# EAGLE design FRDM-Shield-Rev1.1 (EAGLE 6.4)
FRDM-Robot Shield for MC1320x RF Daughter Board
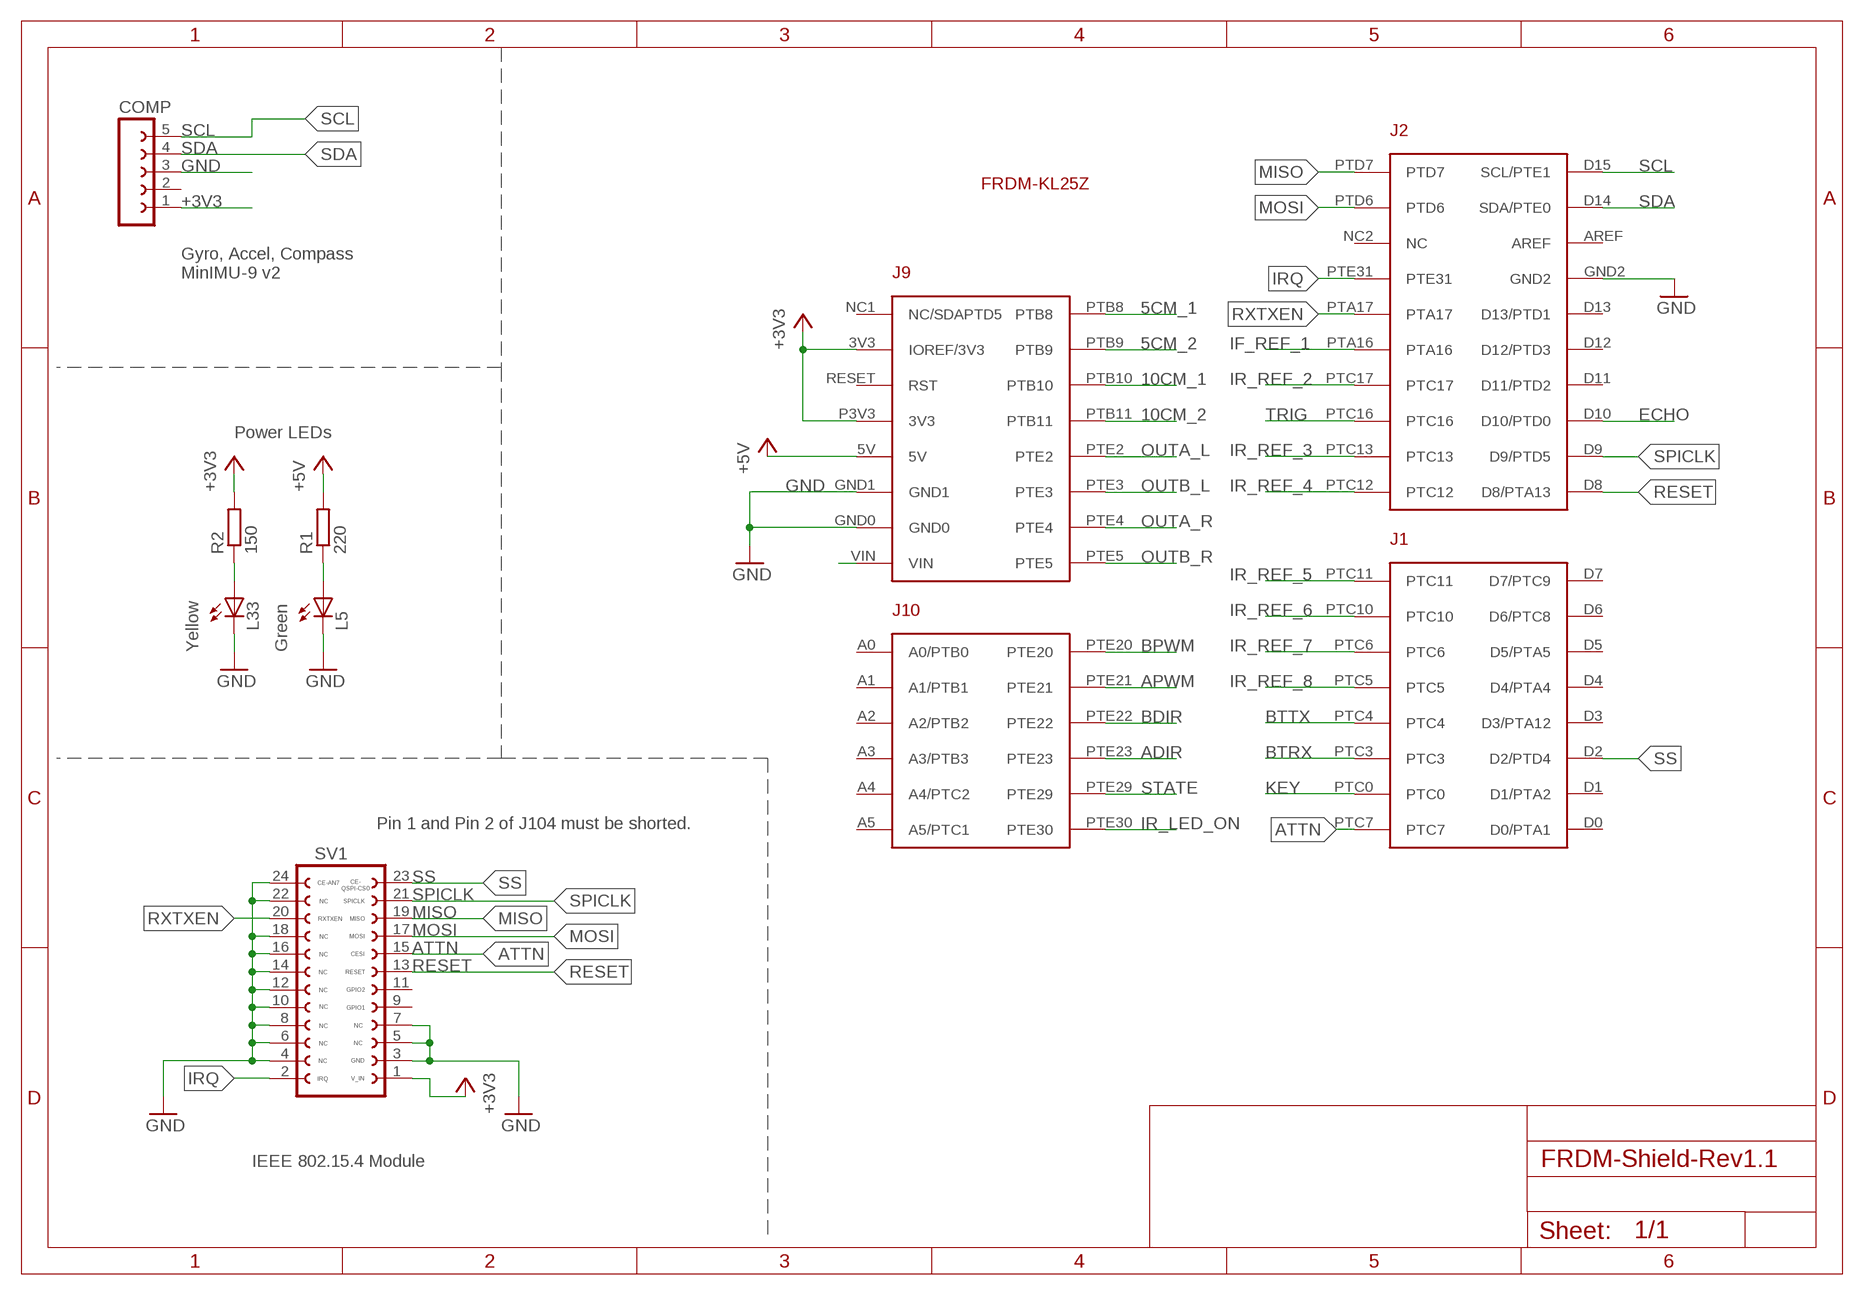
[diagram p0: schematic, sheet 1]

## Parts
COMP  FE05-1  [FE05-1]
FRDM1  FRDM-KL25ZARDUINO  [FRDM-KL25Z]
L5  LEDCHIP-LED0603  [CHIP-LED0603]
L33  LEDCHIP-LED0603  [CHIP-LED0603]
R1  220  R-EU_M0805  [M0805]
R2  150  R-EU_M0805  [M0805]
SV1  MC1320X  [FE12-2]

## Nets
5CM_1: FRDM1.PTB8
5CM_2: FRDM1.PTB9
10CM_1: FRDM1.PTB10
10CM_2: FRDM1.PTB11
+3V3: COMP.1 FRDM1.3V3(IOREF/3V3) FRDM1.P3V3(3V3) R2.2 SV1.1
+5V: FRDM1.5V R1.2
ADIR: FRDM1.PTE23
APWM: FRDM1.PTE21
ATTN: FRDM1.PTC7 SV1.15
BDIR: FRDM1.PTE22
BPWM: FRDM1.PTE20
BTRX: FRDM1.PTC3
BTTX: FRDM1.PTC4
ECHO: FRDM1.D10(D10/PTD0)
GND: COMP.3 FRDM1.GND0 FRDM1.GND1 FRDM1.GND2 L5.C L33.C SV1.3 SV1.4 SV1.5 SV1.6 SV1.7 SV1.8 SV1.10 SV1.12 SV1.14 SV1.16 SV1.18 SV1.22 SV1.24
IF_REF_1: FRDM1.PTA16
IR_LED_ON: FRDM1.PTE30
IR_REF_2: FRDM1.PTC17
IR_REF_3: FRDM1.PTC13
IR_REF_4: FRDM1.PTC12
IR_REF_5: FRDM1.PTC11
IR_REF_6: FRDM1.PTC10
IR_REF_7: FRDM1.PTC6
IR_REF_8: FRDM1.PTC5
IRQ: FRDM1.PTE31 SV1.2
KEY: FRDM1.PTC0
MISO: FRDM1.PTD7 SV1.19
MOSI: FRDM1.PTD6 SV1.17
N$1: FRDM1.VIN
N$4: L5.A R1.1
N$5: L33.A R2.1
OUTA_L: FRDM1.PTE2
OUTA_R: FRDM1.PTE4
OUTB_L: FRDM1.PTE3
OUTB_R: FRDM1.PTE5
RESET: FRDM1.D8(D8/PTA13) SV1.13
RXTXEN: FRDM1.PTA17 SV1.20
SCL: COMP.5 FRDM1.D15(SCL/PTE1)
SDA: COMP.4 FRDM1.D14(SDA/PTE0)
SPICLK: FRDM1.D9(D9/PTD5) SV1.21
SS: FRDM1.D2(D2/PTD4) SV1.23
STATE: FRDM1.PTE29
TRIG: FRDM1.PTC16
Unconnected: COMP.2 FRDM1.A0(A0/PTB0) FRDM1.A1(A1/PTB1) FRDM1.A2(A2/PTB2) FRDM1.A3(A3/PTB3) FRDM1.A4(A4/PTC2) FRDM1.A5(A5/PTC1) FRDM1.AREF FRDM1.D0(D0/PTA1) FRDM1.D1(D1/PTA2) FRDM1.D3(D3/PTA12) FRDM1.D4(D4/PTA4) FRDM1.D5(D5/PTA5) FRDM1.D6(D6/PTC8) FRDM1.D7(D7/PTC9) FRDM1.D11(D11/PTD2) FRDM1.D12(D12/PTD3) FRDM1.D13(D13/PTD1) FRDM1.NC1(NC/SDAPTD5) FRDM1.NC2(NC) FRDM1.RESET(RST) SV1.9 SV1.11

## Notes on the sheet
- Gyro, Accel, Compass
  MinIMU-9 v2
- Power LEDs
- Yellow | Green
- Pin 1 and Pin 2 of J104 must be shorted.
- IEEE 802.15.4 Module

## Library data of the parts
COMP = con-lsta-FRDM:FE05-1: FEMALE HEADER; OC_FARNELL: unknown; OC_NEWARK: unknown
FRDM1 = Freedom:FRDM-KL25Z: For creating FRDM-KL25Z shields
L5 L33 = led:LED: LED OSRAM: - CHIPLED LG R971, LG N971, LY N971, LG Q971, LY Q971, LO R971, LY R971 LH N974, LH R974 LS Q976, LO Q976, LY Q976 LO Q996 - Hyper CHIPLED LW Q18S LB Q993, LB Q99A, LB R99A - SideLED LS A670, LO A670, LY A670, LG A670, LP A670 LB A673, LV A673, LT A673, LW A673 LH A674 LY A675 LS A676, LA A676, LO A676, LY A676, LW A676 LS A679, LY A679, LG A679 - Hyper Micro SIDELED® LS Y876, LA Y876, LO Y876, LY Y876 LT Y87S - SmartLED LW L88C, LW L88S LB L89C, LB L89S, LG L890 LS L89K, LO L89K, LY L89K LS L896, LA L896, LO L896, LY L896 - TOPLED LS T670, LO T670, LY T670, LG T670, LP T670 LSG T670, LSP T670, LSY T670, LOP T670, LYG T670 LG T671, LOG T671, LSG T671 LB T673, LV T673, LT T673, LW T673 LH T674 LS T676, LA T676, LO T676, LY T676, LB T676, LH T676, LSB T676, LW T676 LB T67C, LV T67C, LT T67C, LS T67K, LO T67K, LY T67K, LW E67C LS E67B, LA E67B, LO E67B, LY E67B, LB E67C, LV E67C, LT E67C LW T67C LS T679, LY T679, LG T679 LS T770, LO T770, LY T770, LG T770, LP T770 LB T773, LV T773, LT T773, LW T773 LH T774 LS E675, LA E675, LY E675, LS T675 LS T776, LA T776, LO T776, LY T776, LB T776 LHGB T686 LT T68C, LB T68C - Hyper Mini TOPLED® LB M676 - Mini TOPLED Santana® LG M470 LS M47K, LO M47K, LY M47K Source: http://www.osram.convergy.de LUXEON: - LUMILED® LXK2-PW12-R00, LXK2-PW12-S00, LXK2-PW14-U00, LXK2-PW14-V00 LXK2-PM12-R00, LXK2-PM12-S00, LXK2-PM14-U00 LXK2-PE12-Q00, LXK2-PE12-R00, LXK2-PE12-S00, LXK2-PE14-T00, LXK2-PE14-U00 LXK2-PB12-K00, LXK2-PB12-L00, LXK2-PB12-M00, LXK2-PB14-N00, LXK2-PB14-P00, LXK2-PB14-Q00 LXK2-PR12-L00, LXK2-PR12-M00, LXK2-PR14-Q00, LXK2-PR14-R00 LXK2-PD12-Q00, LXK2-PD12-R00, LXK2-PD12-S00 LXK2-PH12-R00, LXK2-PH12-S00 LXK2-PL12-P00, LXK2-PL12-Q00, LXK2-PL12-R00 Source: www.luxeon.com KINGBRIGHT: KA-3528ASYC Source: www.kingbright.com
R1 R2 = resistor:R-EU_: RESISTOR, European symbol
SV1 = Freescale MC1320x-FRDM:MC1320X: Freescale MC1320x RF Daughter Board Connector

## Board
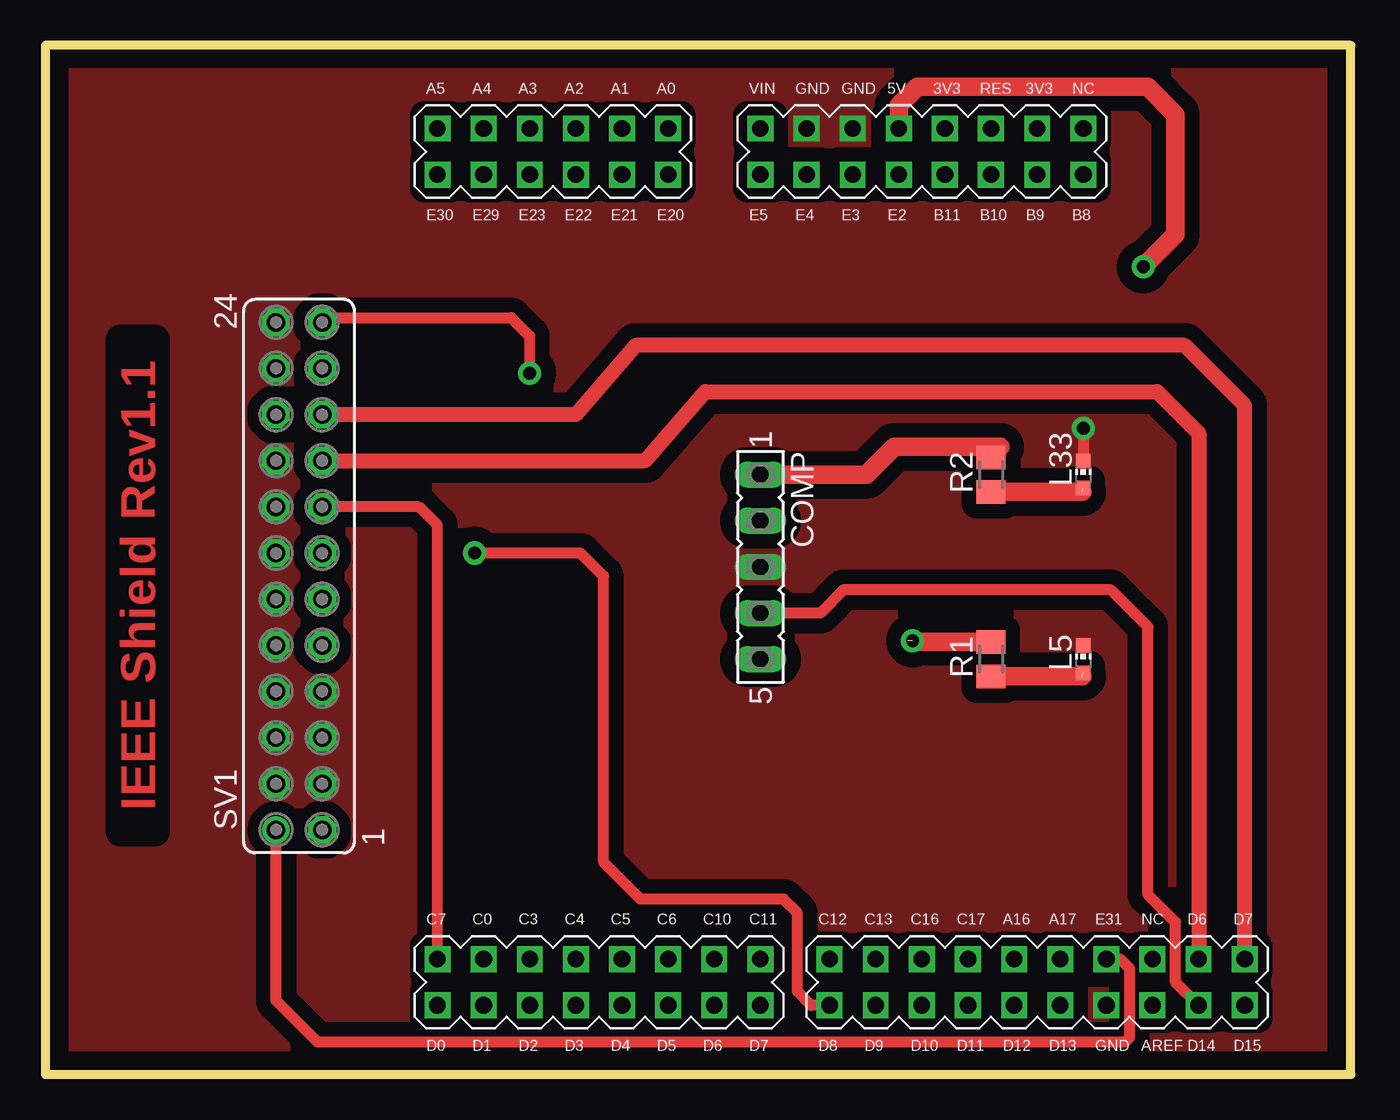
[diagram p1: board, top side]
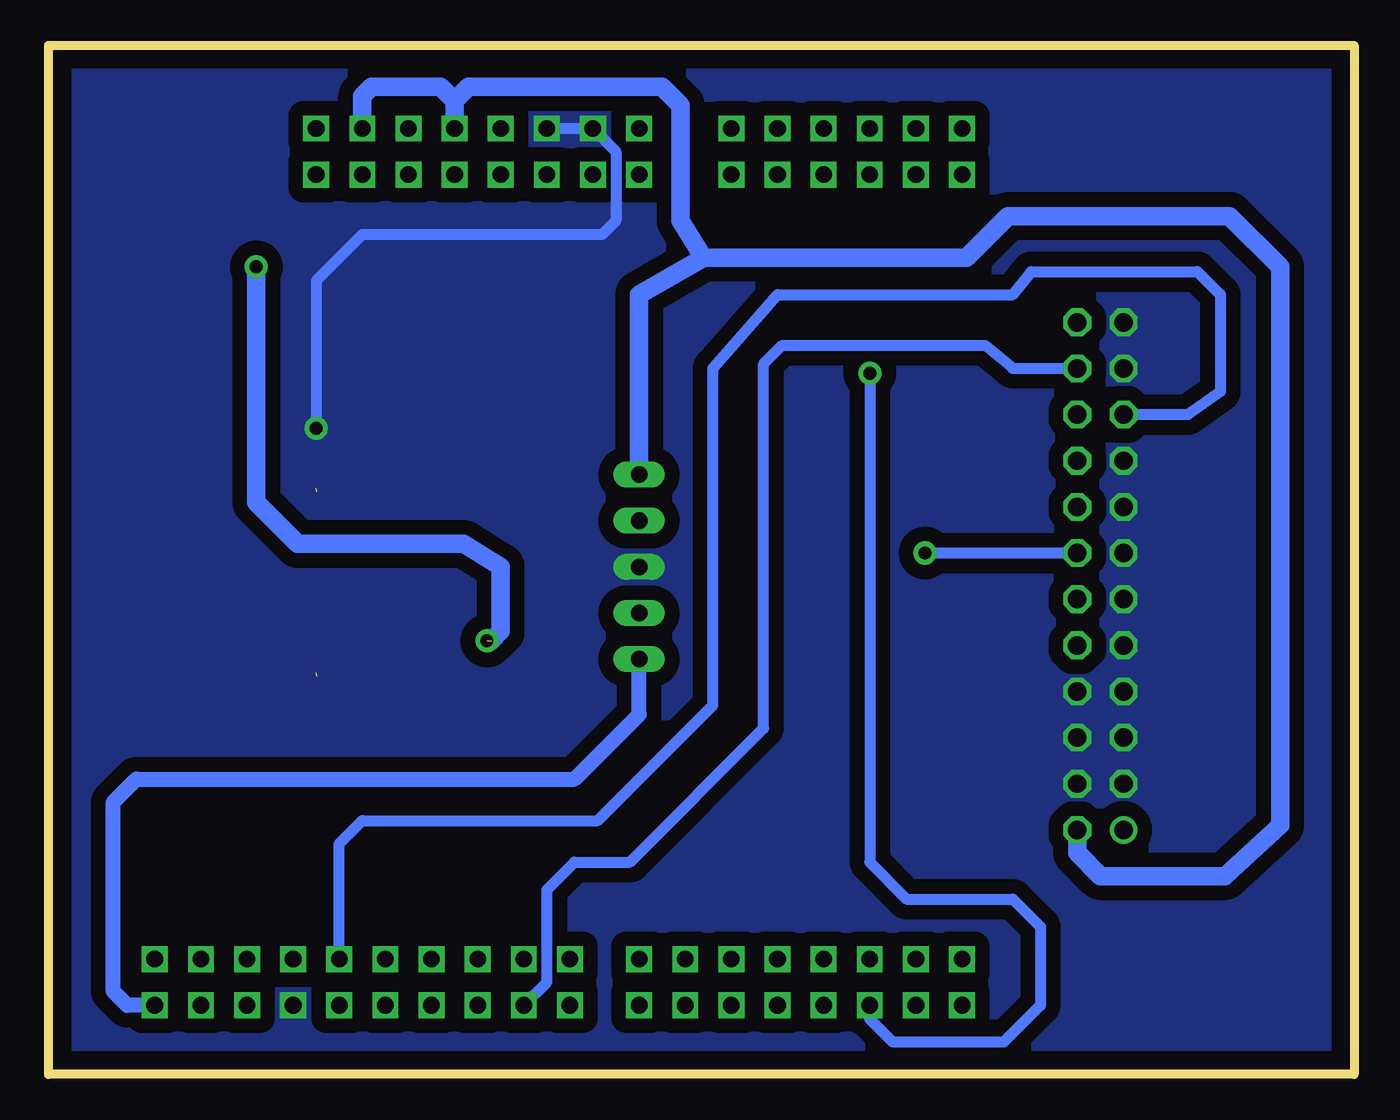
[diagram p2: board, bottom side, seen from below]

Size 72.06 x 56.64 mm. Coordinates in mm from the lower left corner, seen from the top.
Outline: 0,0 72.06,0 72.06,56.63 0,56.63 0,0
Outline: 0,0 71.88,0 71.88,56.64 0,56.64 0,0
Copper layers (1*16): Top 0.035mm / dielectric 1.5mm / Bottom 0.035mm
Design rules "default": minimum track width 10mil, minimum drill 24mil, track to track 8mil, track to pad 8mil, pad to pad 8mil, via to via 8mil, smd to smd 8mil, copper to edge 40mil, drill to drill 8mil, minimum pad ring 10mil, minimum via ring 8mil, stop-mask expansion 4mil, vias tented up to drill 0mil, thermal gap 10mil

### Footprints (pad centres in the part's own frame; a part is rotated, then mirrored left to right if it is on the bottom)
FE05-1 = drill 0.914 long: 1 -5.08,0; 2 -2.54,0; 3 0,0; 4 2.54,0; 5 5.08,0
FRDM-KL25Z = drill 0.914 square: 3V3 -22.86,12.7; 5V -22.86,5.08; A0 -22.86,-7.62; A1 -22.86,-10.16; A2 -22.86,-12.7; A3 -22.86,-15.24; A4 -22.86,-17.78; A5 -22.86,-20.32; AREF 25.4,19.05; D0 25.4,-20.32; D1 25.4,-17.78; D2 25.4,-15.24; D3 25.4,-12.7; D4 25.4,-10.16; D5 25.4,-7.62; D6 25.4,-5.08; D7 25.4,-2.54; D8 25.4,1.27; D9 25.4,3.81; D10 25.4,6.35; D11 25.4,8.89; D12 25.4,11.43; D13 25.4,13.97; D14 25.4,21.59; D15 25.4,24.13; GND0 -22.86,0; GND1 -22.86,2.54; GND2 25.4,16.51; NC1 -22.86,15.24; NC2 22.86,19.05; P3V3 -22.86,7.62; PTA16 22.86,11.43; PTA17 22.86,13.97; PTB8 -20.32,15.24; PTB9 -20.32,12.7; PTB10 -20.32,10.16; PTB11 -20.32,7.62; PTC0 22.86,-17.78; PTC3 22.86,-15.24; PTC4 22.86,-12.7; PTC5 22.86,-10.16; PTC6 22.86,-7.62; PTC7 22.86,-20.32; PTC10 22.86,-5.08; PTC11 22.86,-2.54; PTC12 22.86,1.27; PTC13 22.86,3.81; PTC16 22.86,6.35; PTC17 22.86,8.89; PTD6 22.86,21.59; PTD7 22.86,24.13; PTE2 -20.32,5.08; PTE3 -20.32,2.54; PTE4 -20.32,0; PTE5 -20.32,-2.54; PTE20 -20.32,-7.62; PTE21 -20.32,-10.16; PTE22 -20.32,-12.7; PTE23 -20.32,-15.24; PTE29 -20.32,-17.78; PTE30 -20.32,-20.32; PTE31 22.86,16.51; RESET -22.86,10.16; VIN -22.86,-2.54
CHIP-LED0603 = smd 0.8 x 0.8: A 0,-0.75; C 0,0.75
M0805 = smd 1.3 x 1.6: 1 -0.95,0; 2 0.95,0
FE12-2 = drill 1.016 octagon: 1 -13.97,-1.27; 3 -11.43,-1.27; 4 -11.43,1.27; 5 -8.89,-1.27; 6 -8.89,1.27; 7 -6.35,-1.27; 8 -6.35,1.27; 9 -3.81,-1.27; 10 -3.81,1.27; 11 -1.27,-1.27; 12 -1.27,1.27; 13 1.27,-1.27; 14 1.27,1.27; 15 3.81,-1.27; 16 3.81,1.27; 17 6.35,-1.27; 18 6.35,1.27; 19 8.89,-1.27; 20 8.89,1.27; 21 11.43,-1.27; 22 11.43,1.27; 23 13.97,-1.27; 24 13.97,1.27 | drill 1.016: 2 -13.97,1.27

### Placement (x,y rotation side)
COMP  39.37,27.94 270 top
FRDM1  41.91,29.21 270 top
L5  57.15,22.86 0 top
L33  57.15,33.02 0 top
R1  52.07,22.86 90 top
R2  52.07,33.02 90 top
SV1  13.97,27.43 90 top

### Tracks (layer width: path | path; a pad name or v marks a point on that pad's centre or on a via)
+3V3
  Top 1.016: COMP.1 45.21,33.02 46.74,34.54 52.58,34.54 52.07,34.04 R2.2
  Bottom 1.016: SV1.1 15.24,12.19 13.97,10.92 7.11,10.92 4.06,13.72 4.06,44.45 6.86,47.24 19.05,47.24 21.34,44.96 35.81,44.96 | 35.81,44.96 39.37,42.93 COMP.1 | FRDM1.P3V3 49.53,53.59 | 49.53,53.59 48.77,54.36 38.1,54.36 37.08,53.34 37.08,46.99 35.81,44.96 | FRDM1.3V3 54.61,53.85 54.1,54.36 50.29,54.36 49.53,53.59
+5V  (via drill 0.71 pad 1.27)  (1 unrouted)
  Top 1.016: FRDM1.5V 46.99,53.34 48.01,54.36 60.71,54.36 62.23,52.83 62.23,46.23 v60.45,44.45 | R1.2 47.82,23.81 v47.75,23.88
  Bottom 1.016: v60.45,44.45 60.45,31.5 58.17,29.21 49.02,29.21 46.99,27.94 46.99,24.38 47.5,23.88
ATTN
  Top 0.61: FRDM1.PTC7 21.59,30.23 20.57,31.24 SV1.15
GND  (via drill 0.71 pad 1.27)
  Top 0.61: v57.15,35.56 L33.C
  Bottom 0.61: FRDM1.GND1 FRDM1.GND0 40.64,50.8 40.64,46.99 41.4,46.23 54.61,46.23 57.15,43.69 v57.15,35.56
  pour Bottom (isolate 0.813, no thermals): 0.51,56.13 71.37,56.13 71.37,0.51 0.51,0.51
  pour Top (isolate 0.813, no thermals): 0.51,55.88 71.37,55.88 71.37,0.25 0.51,0.25
IRQ
  Top 0.61: FRDM1.PTE31 59.18,6.35 59.69,5.84 59.69,2.03 59.44,1.78 14.99,1.78 12.7,4.06 SV1.2
MISO
  Top 0.813: FRDM1.PTD7 66.04,36.83 62.74,40.13 32.51,40.13 29.21,36.32 SV1.19
MOSI
  Top 0.813: SV1.17 33.02,33.78 36.32,37.59 61.21,37.59 63.5,35.31 FRDM1.PTD6
N$4  (1 unrouted)
  Top 1.016: R1.1 57.08,21.91
N$5  (1 unrouted)
  Top 1.016: R2.1 57.08,32.07
RESET  (via drill 0.71 pad 1.27)
  Top 0.61: FRDM1.D8 42.16,3.81 41.4,4.57 41.4,8.89 40.64,9.65 32.77,9.65 30.73,11.68 30.73,27.43 29.46,28.7 v23.62,28.7
  Bottom 0.61: SV1.13 v23.62,28.7
RXTXEN
  Bottom 0.61: FRDM1.PTA17 55.88,12.7 54.61,13.97 41.66,13.97 35.31,20.32 35.31,38.86 31.75,42.93 18.8,42.93 17.78,44.2 8.64,44.2 7.37,42.93 7.37,37.59 9.14,36.32 SV1.20
SCL
  Bottom 0.813: FRDM1.D15 67.56,3.81 68.33,4.57 68.33,14.99 67.06,16.26 42.93,16.26 39.37,19.81 COMP.5
SDA
  Top 0.61: FRDM1.D14 62.23,5.08 62.23,8.38 60.71,9.91 60.71,24.64 58.67,26.67 43.94,26.67 42.67,25.4 COMP.4
SPICLK
  Bottom 0.61: FRDM1.D9 44.45,5.08 44.45,10.16 42.93,11.68 39.88,11.68 32.51,19.05 32.51,39.12 31.5,40.13 20.32,40.13 18.8,38.86 SV1.21
SS  (via drill 0.71 pad 1.27)
  Top 0.61: SV1.23 15.49,41.66 25.65,41.66 26.67,40.64 v26.67,38.61
  Bottom 0.61: v26.67,38.61 26.67,11.68 24.64,9.65 18.8,9.65 17.27,8.13 17.27,3.81 19.3,1.78 25.4,1.78 26.67,3.05 FRDM1.D2

### Text on the board
Top: IEEE Shield Rev1.1